# Altium schematic sheet LED_Board.SchDoc
size A
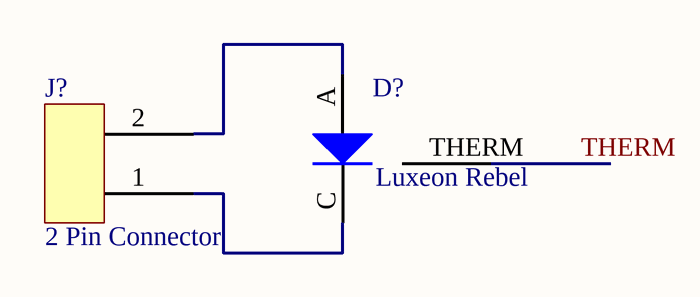
[diagram p0: LED_Board.SchDoc]

## Parts
D?  Luxeon Rebel  [Luxeon Rebel]
J?  2 Pin Connector  [2pin smd pad for LED connector]

## Nets
THERM: D?.THERM
NetD?_A: D?.A J?.2
NetD?_C: D?.C J?.1